# EAGLE design piezo-buffer-and-preamp-ritter_copperclad (EAGLE 7.5.0)
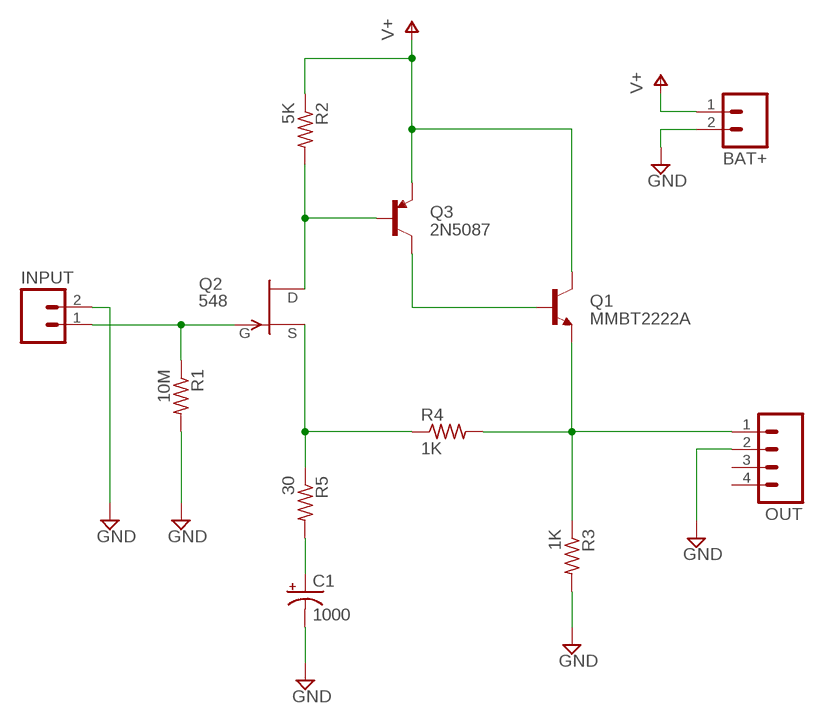
[diagram p0: schematic, sheet 1]

## Parts
BAT+  M02LOCK  [1X02_LOCK]
C1  1000  CAP_POLPTH2  [CPOL-RADIAL-10UF-25V]
INPUT  M02LOCK  [1X02_LOCK]
OUT  M04PTH  [1X04]
Q1  MMBT2222A  TRANSISTOR_NPNTO92  [TO-92]
Q2  548  [TO-92]
Q3  2N5087  TRANSISTOR_PNPTO92  [TO-92]
R1  10M  R-US_VMTA55  [VMTA55]
R2  5K  R-US_VMTA55  [VMTA55]
R3  1K  R-US_VMTA55  [VMTA55]
R4  1K  R-US_VMTA55  [VMTA55]
R5  30  R-US_VMTA55  [VMTA55]

## Nets
GND: BAT+.2 C1.2(-) INPUT.2 OUT.2 R1.2 R3.2
N$1: INPUT.1 Q2.1(G) R1.1
N$2: Q2.3(D) Q3.2(B) R2.2
N$3: OUT.1 Q1.1(E) R3.1 R4.2
N$4: Q2.2(S) R4.1 R5.1
N$5: Q1.2(B) Q3.3(C)
N$6: C1.1(+) R5.2
V+: BAT+.1 Q1.3(C) Q3.1(E) R2.1
Unconnected: OUT.3 OUT.4

## Library data of the parts
BAT+ INPUT = CMU-ArtFab:M02: Header 2 Standard 2-pin 0.1" header. Use with straight break away headers (SKU : PRT-00116), right angle break away headers (PRT-00553), swiss pins (PRT-00743), machine pins (PRT-00117), and female headers (PRT-00115). Molex polarized connector foot print use with SKU : PRT-08233 with associated crimp pins and housings.
C1 = SparkFun-Capacitors:CAP_POL: Capacitor Polarized These are standard SMD and PTH capacitors. Normally 10uF, 47uF, and 100uF in electrolytic and tantalum varieties. Always verify the external diameter of the through hole cap, it varies with capacity, voltage, and manufacturer. The EIA devices should be standard.
OUT = SparkFun-Connectors:M04: Header 4 Standard 4-pin 0.1" header. Use with straight break away headers (SKU : PRT-00116), right angle break away headers (PRT-00553), swiss pins (PRT-00743), machine pins (PRT-00117), and female headers (PRT-00115). Molex polarized connector foot print use with SKU : PRT-08231 with associated crimp pins and housings. 1MM SMD Version SKU: PRT-10208
Q1 = CMU-ArtFab:TRANSISTOR_NPN: Generic NPN BJT MMBT2222A - TRANS-08049 (SOT-23, 1A 40V) MPSA42 - TRANS-09116 (SOT-23, 500mA 300V) MMBT5088LT1G - TRANS-11160 (SOT-23, 50 mA 30V) BC547 - COM-08928 <http://www.sparkfun.com/products/8928> (TO-92 45V 100mA) (1.Collector 2.Base 3.Emitter) 2N3904 - COM-00521 <http://www.sparkfun.com/products/521> (TO-92 40V 200mA) (1.Emitter 2.Base 3.Collector) P2N2222A - COM-12852 <http://www.sparkfun.com/products/12852> (TO-92 40V 600mA) (1.Collector 2.Base 3.Emitter)
Q2 = CMU-ArtFab:?548*: N-Channel JFETs Source: VISHAY 2N5484.pdf Compatible: TO92 2N5245 J304 J305 U310 J308 J309 J310 TO72 2N4416 2N4416A 2N3823 2N4351 3N169 3N170 3N171 MFE3002 TO18 2N3796 2N3797 MFE825 Source: Motorola European Master Guide Pacge 3-59
Q3 = CMU-ArtFab:TRANSISTOR_PNP: Generic PNP BJT Double check pinouts against datasheets- not all devices are the same! MMBT3906 - 40V 200mA SOT-23 (TRANS-08052) MMBT4403 - 40V 600mA SOT-23 (TRANS-09245)
R1-R5 = resistor:R-US_: RESISTOR, American symbol

## Net classes
0 default: width 0.6 mm, clearance 0.1 mm

## Board
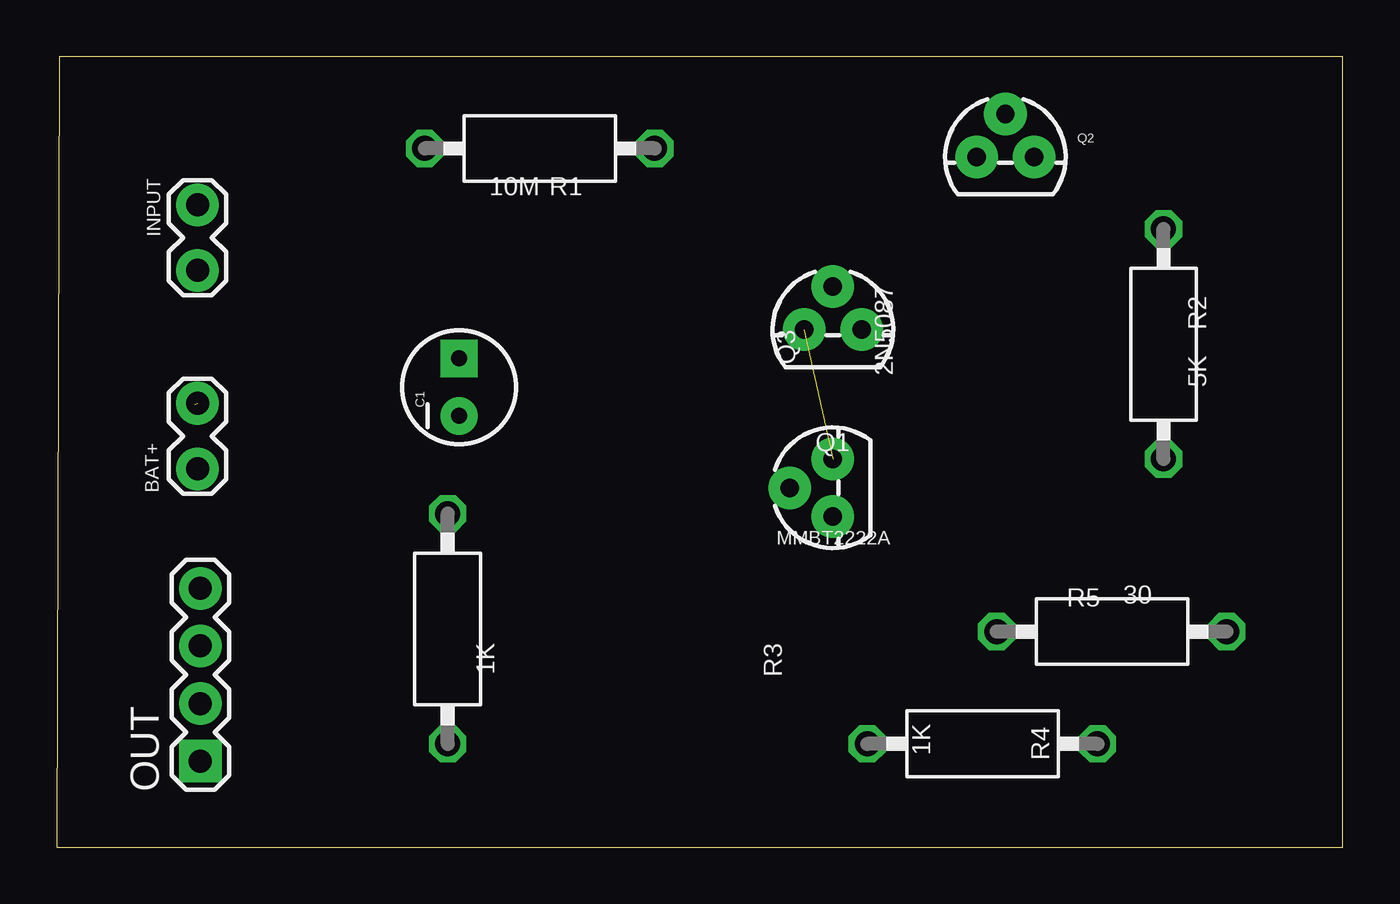
[diagram p1: board, top side]
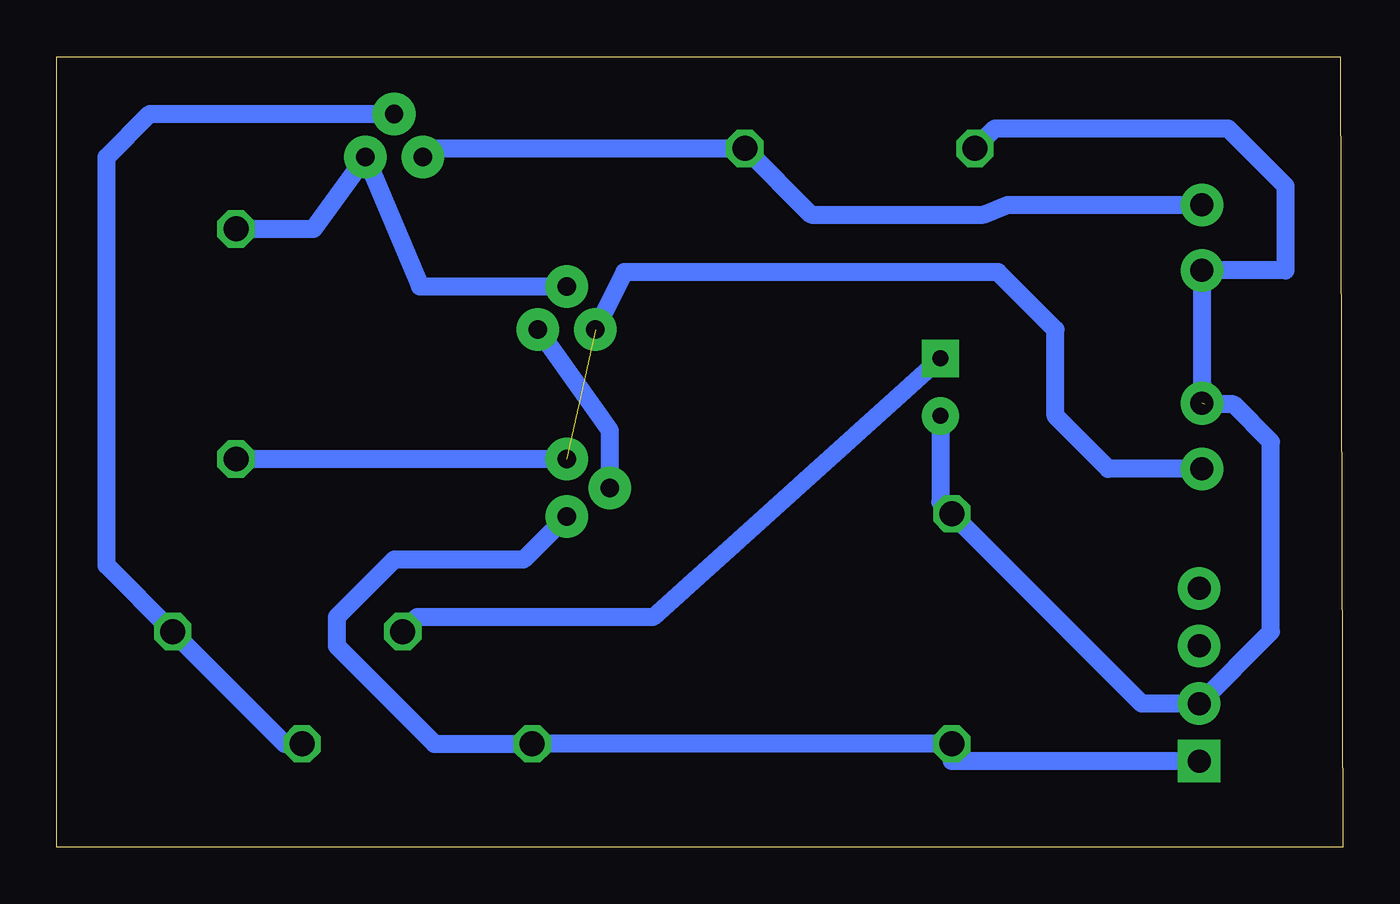
[diagram p2: board, bottom side, seen from below]

Size 56.82 x 34.91 mm. Coordinates in mm from the lower left corner, seen from the top.
Outline: 0,0 56.82,0 56.82,34.91 0.13,34.91 0,0
Copper layers (1*16): Top 0.035mm / dielectric 1.5mm / Bottom 0.035mm
Design rules "default *": minimum track width 24mil, minimum drill 24mil, track to track 24mil, track to pad 24mil, pad to pad 24mil, via to via 24mil, smd to smd 24mil, copper to edge 40mil, drill to drill 16mil, minimum pad ring 10mil, minimum via ring 8mil, stop-mask expansion 4mil, vias tented up to drill 0mil, thermal gap 10mil

### Footprints (pad centres in the part's own frame; a part is rotated, then mirrored left to right if it is on the bottom)
1X02_LOCK = drill 1.016 pad 1.88: 1 -0.178,0; 2 2.718,0
CPOL-RADIAL-10UF-25V = drill 0.7 pad 1.651 square: 1 1.27,0 | drill 0.7 pad 1.651: 2 -1.27,0
1X04 = drill 1.016 pad 1.88 square: 1 0,0 | drill 1.016 pad 1.88: 2 2.54,0; 3 5.08,0; 4 7.62,0
TO-92 = drill 0.813 pad 1.88: 1 -1.27,0; 2 0,1.905; 3 1.27,0
VMTA55 = drill 1.1 octagon: 1 -5.08,0; 2 5.08,0

### Placement (x,y rotation side)
BAT+  6.22,16.89 90 top
C1  17.78,20.32 90 top
INPUT  6.22,28.19 270 top
OUT  6.35,3.81 90 top
Q1  34.29,15.88 90 top
Q2  41.91,30.48 0 top
Q3  34.29,22.86 0 top
R1  21.34,30.86 180 top
R2  48.9,22.23 90 top
R3  17.27,9.65 90 top
R4  40.89,4.57 180 top
R5  46.61,9.53 180 top

### Tracks (layer width: path | path; a pad name or v marks a point on that pad's centre or on a via)
GND  (1 unrouted)
  Bottom 0.8: BAT+.2 INPUT.2 2.54,25.48 2.54,29.21 5.08,31.75 15.37,31.75 R1.2 | C1.2 17.78,15.24 R3.2 8.89,6.35 OUT.2 3.17,9.53 3.17,17.91 4.83,19.56 6.1,19.56
N$1
  Bottom 0.8: Q2.1 40.26,30.86 R1.1 23.5,27.94 15.88,27.94 14.81,28.37 INPUT.1
N$2
  Bottom 0.8: R2.2 45.47,27.3 Q2.3 40.77,24.77 Q3.2
N$3
  Bottom 0.8: OUT.1 17.27,3.81 R3.1 R4.2 40.13,4.57 44.45,8.89 44.45,10.16 41.91,12.7 36.2,12.7 Q1.1
N$4
  Bottom 0.8: R4.1 46.74,4.57 R5.1 54.61,12.45 54.61,30.48 52.7,32.38 Q2.2
N$5
  Bottom 0.8: Q3.3 32.38,18.41 Q1.2
N$6
  Bottom 0.8: C1.1 30.48,10.16 40.89,10.16 R5.2
V+  (1 unrouted)
  Bottom 0.8: Q1.3 R2.1 | BAT+.1 10.36,16.71 12.7,19.05 12.7,22.86 15.24,25.4 31.75,25.4 Q3.1